# Altium schematic sheet CPCIS_Connectors_P1_P6.SchDoc: =P_Title
size 420 x 297 mm; Author: M.Mroz; CompanyName: WUT ISE; DrawnBy: M.Mroz; Organization: WUT ISE; Address1: PW ISE; Address2: Nowowiejska 15/19 00-665 Warsaw; Address3: gkasprow@gmail.com; Revision: 2; SheetNumber: 19; ModifiedBy: M.Mroz; Title2: CPCIS Connectors
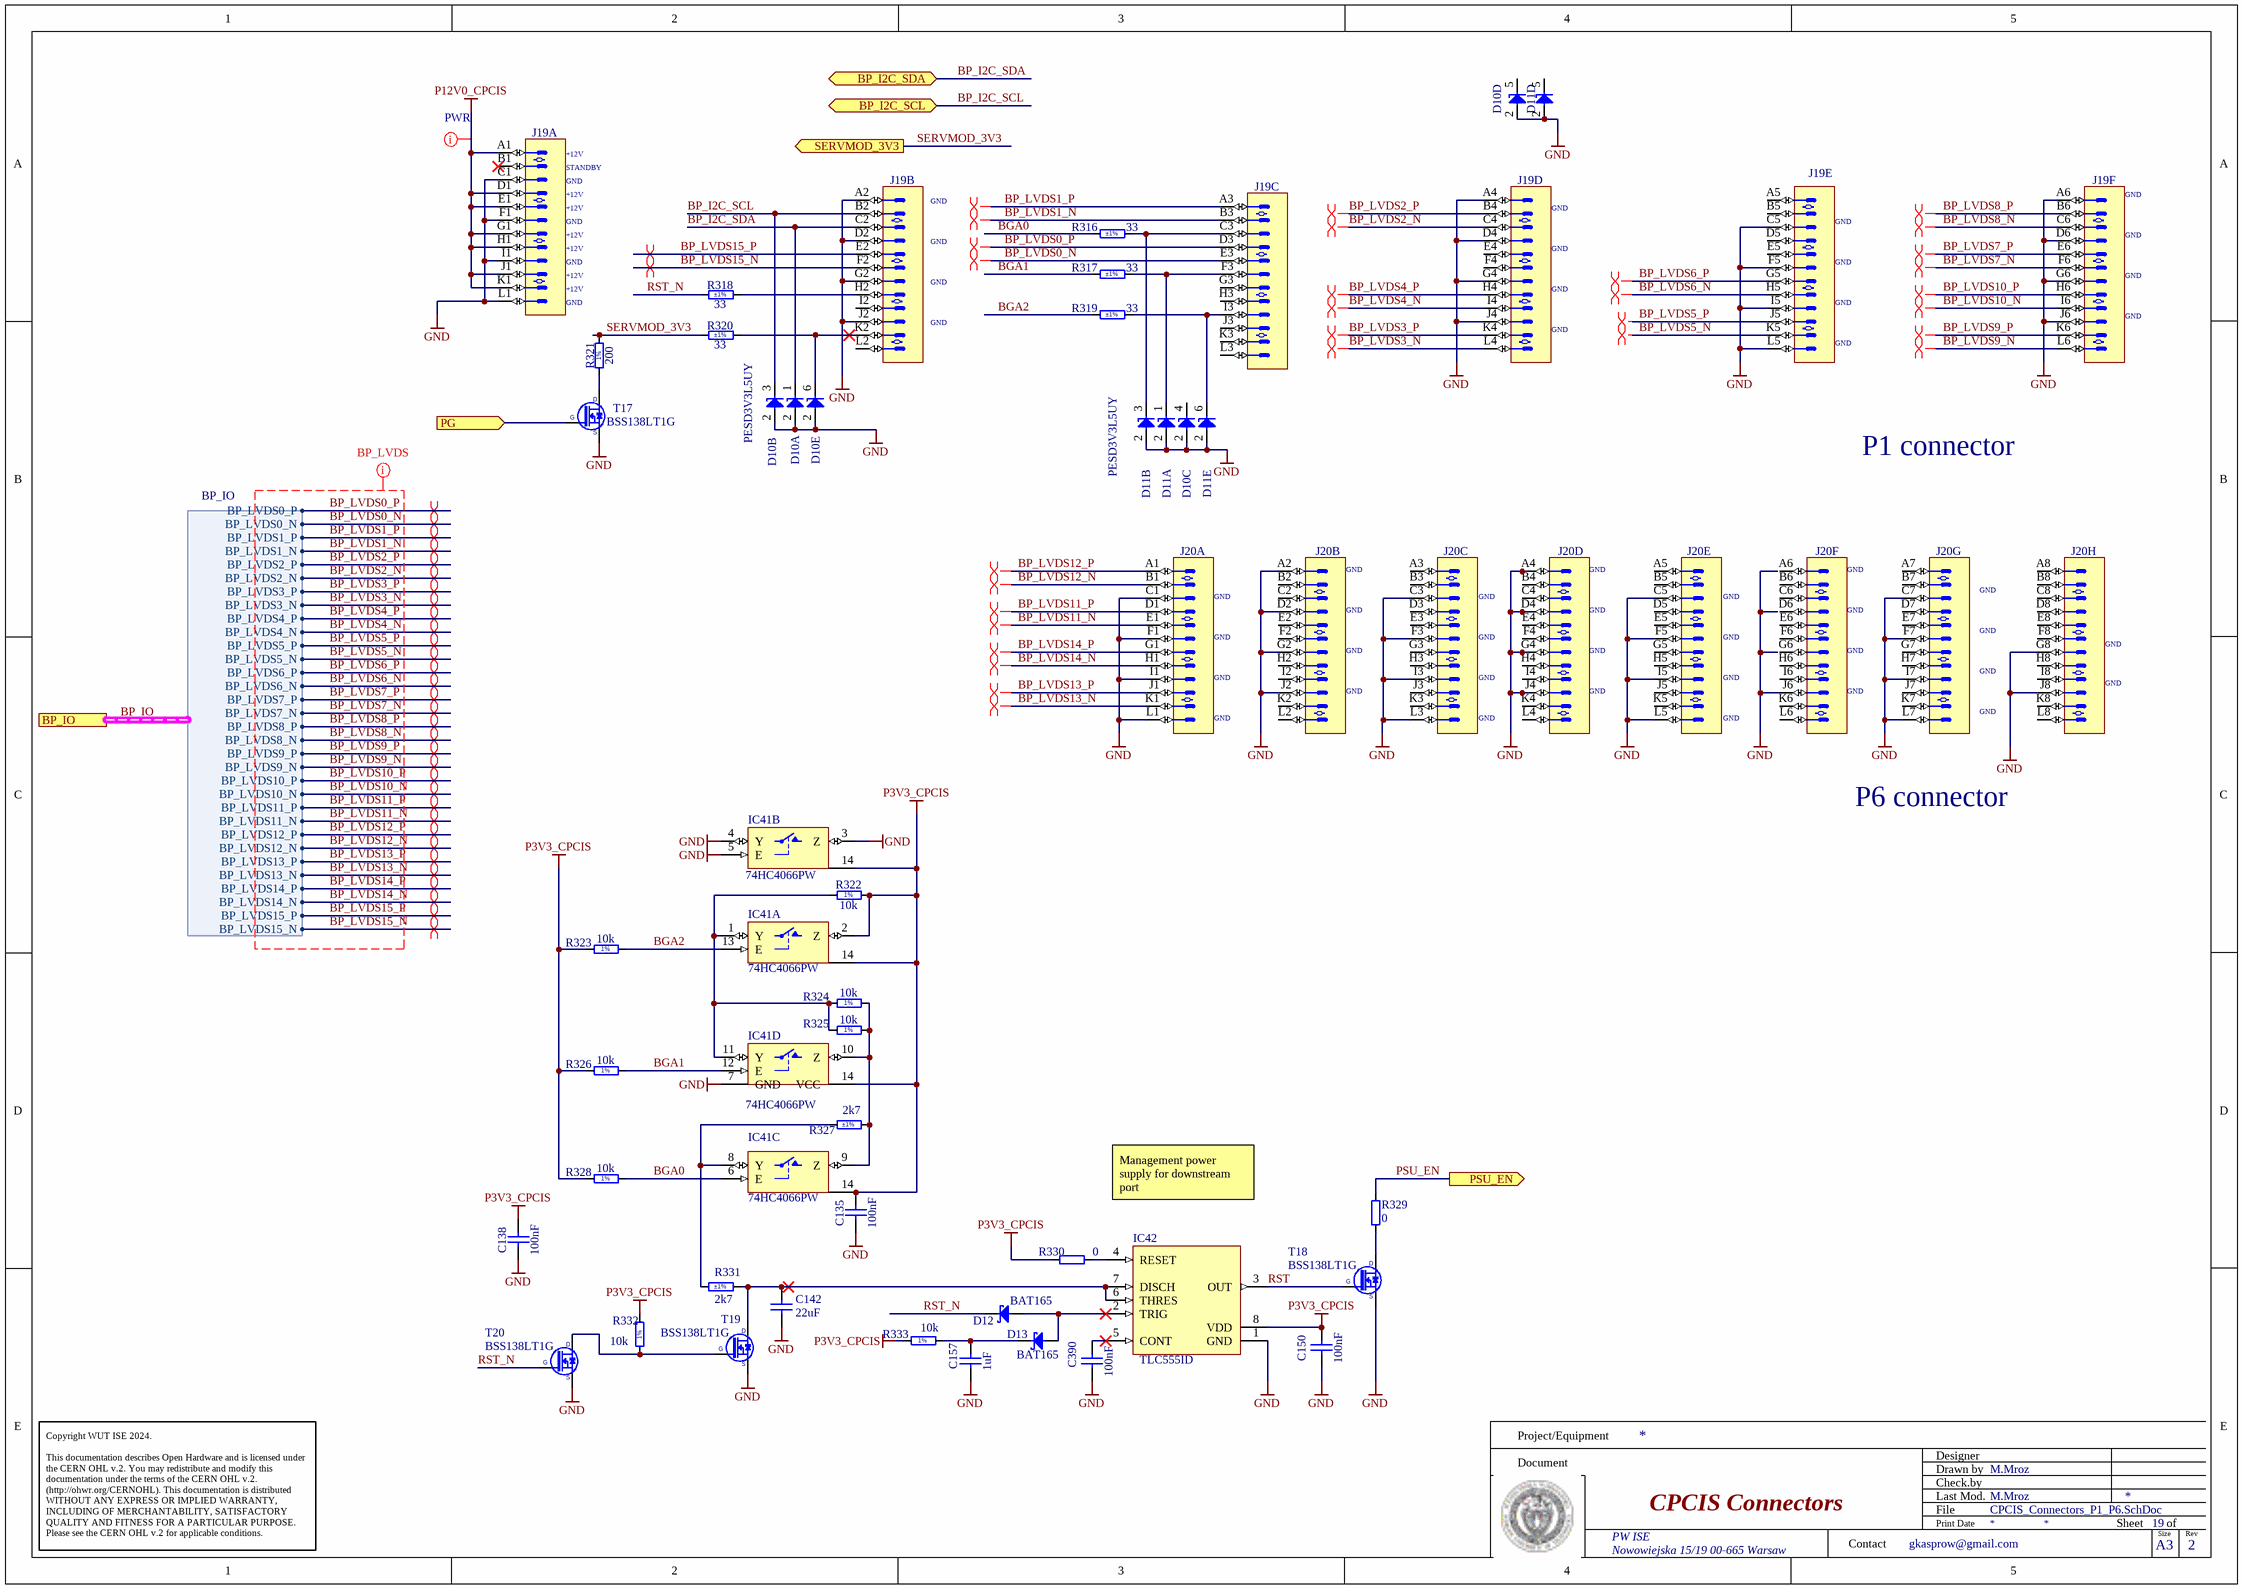
[diagram p0: CPCIS_Connectors_P1_P6.SchDoc]

## Parts
C135  100nF  [CAPC1005X55N]
C138  100nF  [CAPC1005X55N]
C142  22uF  [CAPC2012X135N]
C150  100nF  [CAPC1005X55N]
C157  1uF  [CAPC1608X87N]
C390  100nF  [CAPC1005X55N]
D10  PESD3V3L5UY  [SOT65P210X110-6N]  (value not drawn)  (parts A,B,C,D,E of 5)
D11  PESD3V3L5UY  [SOT65P210X110-6N]  (value not drawn)  (parts A,B,D,E of 5)
D12  BAT165  [SOD2512X110N]
D13  BAT165  [SOD2512X110N]
IC41  74HC4066PW  [SOP65P640X110-14N]  (parts A,B,C,D of 4)
IC42  TLC555ID  [SOIC127P600X175-8N]
J19  (no value)  [AMPHENOL_10052825-101LF]  (parts A,B,C,D,E,F of 6)
J20  (no value)  [AMPHENOL_10052838-101LF]  (parts A,B,C,D,E,F,G,H of 8)
R316  33  Tolerance: ±1%  [RESC1005X40N]
R317  33  Tolerance: ±1%  [RESC1005X40N]
R318  33  Tolerance: ±1%  [RESC1005X40N]
R319  33  Tolerance: ±1%  [RESC1005X40N]
R320  33  Tolerance: ±1%  [RESC1005X40N]
R321  200  [RESC1005X40N]
R322  10k  [RESC1005X40N]
R323  10k  [RESC1005X40N]
R324  10k  [RESC1005X40N]
R325  10k  [RESC1005X40N]
R326  10k  [RESC1005X40N]
R327  2k7  Tolerance: ±1%  [RESC1608X55N]
R328  10k  [RESC1005X40N]
R329  0  [RESC1005X35N]
R330  0  [RESC1005X35N]
R331  2k7  Tolerance: ±1%  [RESC1608X55N]
R332  10k  [RESC1005X40N]
R333  10k  [RESC1005X40N]
T17  BSS138LT1G  [SOT95P240X110-3N]
T18  BSS138LT1G  [SOT95P240X110-3N]
T19  BSS138LT1G  [SOT95P240X110-3N]
T20  BSS138LT1G  [SOT95P240X110-3N]

## Ports
BP_I2C_SCL (bidir), BP_I2C_SDA (bidir), BP_IO (harness BP_IO), PG (in), PSU_EN (out), SERVMOD_3V3 (out)

## Harnesses
BP_IO: BP_LVDS0_P, BP_LVDS0_N, BP_LVDS1_P, BP_LVDS1_N, BP_LVDS2_P, BP_LVDS2_N, BP_LVDS3_P, BP_LVDS3_N, BP_LVDS4_P, BP_LVDS4_N, BP_LVDS5_P, BP_LVDS5_N, BP_LVDS6_P, BP_LVDS6_N, BP_LVDS7_P, BP_LVDS7_N, BP_LVDS8_P, BP_LVDS8_N, BP_LVDS9_P, BP_LVDS9_N, BP_LVDS10_P, BP_LVDS10_N, BP_LVDS11_P, BP_LVDS11_N, BP_LVDS12_P, BP_LVDS12_N, BP_LVDS13_P, BP_LVDS13_N, BP_LVDS14_P, BP_LVDS14_N, BP_LVDS15_P, BP_LVDS15_N

## Nets
GND: C135.1 C138.1 C142.1 C150.1 C157.1 C390.1 D10.2(A) D11.2(A) IC41.3(Z) IC41.4(Y) IC41.5(E) IC41.7(GND) IC42.1(GND) J19.A2 J19.A4 J19.A6 J19.C1 J19.C5 J19.D2 J19.D4 J19.D6 J19.F1 J19.F5 J19.G2 J19.G4 J19.G6 J19.I1 J19.I5 J19.J2 J19.J4 J19.J6 J19.L1 J19.L5 J20.A2 J20.A4 J20.C1 J20.C3 J20.C5 J20.C7 J20.D2 J20.D4 J20.F1 J20.F3 J20.F5 J20.F7 J20.G2 J20.G4 J20.G8 J20.I1 J20.I3 J20.I5 J20.I7 J20.J2 J20.J4 J20.J6 J20.J8 J20.L1 J20.L3 J20.L5 J20.L7 T17.2(S) T18.2(S) T19.2(S) T20.2(S)
P3V3_CPCIS: C135.2 C138.2 C150.2 IC41.2(Z) IC41.14(VCC) IC42.8(VDD) R322.2 R323.1 R326.1 R328.1 R330.2 R332.2 R333.1
P12V0_CPCIS: J19.A1 J19.D1 J19.E1 J19.G1 J19.H1 J19.J1 J19.K1
BGA0: IC41.6(E) R316.1 R328.2
BGA1: IC41.12(E) R317.1 R326.2
BGA2: IC41.13(E) R319.1 R323.2
BP_I2C_SCL: D10.3(C) J19.B2 ; port BP_I2C_SCL
BP_I2C_SDA: D10.1(C) J19.C2 ; port BP_I2C_SDA
BP_LVDS0_N: J19.E3 ; port BP_IO.BP_LVDS0_N  [project net BP_IO.BP_LVDS0_N]
BP_LVDS0_P: J19.D3 ; port BP_IO.BP_LVDS0_P  [project net BP_IO.BP_LVDS0_P]
BP_LVDS1_N: J19.B3 ; port BP_IO.BP_LVDS1_N  [project net BP_IO.BP_LVDS1_N]
BP_LVDS1_P: J19.A3 ; port BP_IO.BP_LVDS1_P  [project net BP_IO.BP_LVDS1_P]
BP_LVDS2_N: J19.C4 ; port BP_IO.BP_LVDS2_N  [project net BP_IO.BP_LVDS2_N]
BP_LVDS2_P: J19.B4 ; port BP_IO.BP_LVDS2_P  [project net BP_IO.BP_LVDS2_P]
BP_LVDS3_N: J19.L4 ; port BP_IO.BP_LVDS3_N  [project net BP_IO.BP_LVDS3_N]
BP_LVDS3_P: J19.K4 ; port BP_IO.BP_LVDS3_P  [project net BP_IO.BP_LVDS3_P]
BP_LVDS4_N: J19.I4 ; port BP_IO.BP_LVDS4_N  [project net BP_IO.BP_LVDS4_N]
BP_LVDS4_P: J19.H4 ; port BP_IO.BP_LVDS4_P  [project net BP_IO.BP_LVDS4_P]
BP_LVDS5_N: J19.K5 ; port BP_IO.BP_LVDS5_N  [project net BP_IO.BP_LVDS5_N]
BP_LVDS5_P: J19.J5 ; port BP_IO.BP_LVDS5_P  [project net BP_IO.BP_LVDS5_P]
BP_LVDS6_N: J19.H5 ; port BP_IO.BP_LVDS6_N  [project net BP_IO.BP_LVDS6_N]
BP_LVDS6_P: J19.G5 ; port BP_IO.BP_LVDS6_P  [project net BP_IO.BP_LVDS6_P]
BP_LVDS7_N: J19.F6 ; port BP_IO.BP_LVDS7_N  [project net BP_IO.BP_LVDS7_N]
BP_LVDS7_P: J19.E6 ; port BP_IO.BP_LVDS7_P  [project net BP_IO.BP_LVDS7_P]
BP_LVDS8_N: J19.C6 ; port BP_IO.BP_LVDS8_N  [project net BP_IO.BP_LVDS8_N]
BP_LVDS8_P: J19.B6 ; port BP_IO.BP_LVDS8_P  [project net BP_IO.BP_LVDS8_P]
BP_LVDS9_N: J19.L6 ; port BP_IO.BP_LVDS9_N  [project net BP_IO.BP_LVDS9_N]
BP_LVDS9_P: J19.K6 ; port BP_IO.BP_LVDS9_P  [project net BP_IO.BP_LVDS9_P]
BP_LVDS10_N: J19.I6 ; port BP_IO.BP_LVDS10_N  [project net BP_IO.BP_LVDS10_N]
BP_LVDS10_P: J19.H6 ; port BP_IO.BP_LVDS10_P  [project net BP_IO.BP_LVDS10_P]
BP_LVDS11_N: J20.E1 ; port BP_IO.BP_LVDS11_N  [project net BP_IO.BP_LVDS11_N]
BP_LVDS11_P: J20.D1 ; port BP_IO.BP_LVDS11_P  [project net BP_IO.BP_LVDS11_P]
BP_LVDS12_N: J20.B1 ; port BP_IO.BP_LVDS12_N  [project net BP_IO.BP_LVDS12_N]
BP_LVDS12_P: J20.A1 ; port BP_IO.BP_LVDS12_P  [project net BP_IO.BP_LVDS12_P]
BP_LVDS13_N: J20.K1 ; port BP_IO.BP_LVDS13_N  [project net BP_IO.BP_LVDS13_N]
BP_LVDS13_P: J20.J1 ; port BP_IO.BP_LVDS13_P  [project net BP_IO.BP_LVDS13_P]
BP_LVDS14_N: J20.H1 ; port BP_IO.BP_LVDS14_N  [project net BP_IO.BP_LVDS14_N]
BP_LVDS14_P: J20.G1 ; port BP_IO.BP_LVDS14_P  [project net BP_IO.BP_LVDS14_P]
BP_LVDS15_N: J19.F2 ; port BP_IO.BP_LVDS15_N  [project net BP_IO.BP_LVDS15_N]
BP_LVDS15_P: J19.E2 ; port BP_IO.BP_LVDS15_P  [project net BP_IO.BP_LVDS15_P]
PG: T17.1(G) ; port PG
PSU_EN: R329.1 ; port PSU_EN
RST: IC42.3(OUT) T18.1(G)
RST_N: D12.1(C) R318.1 T20.1(G)
SERVMOD_3V3: R320.1 R321.2 ; port SERVMOD_3V3
NetC142_2: C142.2 IC42.6(THRES) IC42.7(DISCH) R331.2 T19.3(D)
NetC157_2: C157.2 D13.1(C) R333.2
NetC390_2: C390.2 IC42.5(CONT)
NetD10_6: D10.6(C) J19.K2 R320.2
NetD11_1: D11.1(C) J19.F3 R317.2
NetD11_3: D11.3(C) J19.C3 R316.2
NetD11_6: D11.6(C) J19.I3 R319.2
NetD12_2: D12.2(A) D13.2(A) IC42.2(TRIG)
NetIC41_1: IC41.1(Y) IC41.11(Y) R322.1 R324.1 R325.1
NetIC41_8: IC41.8(Y) R327.1 R331.1
NetIC41_9: IC41.9(Z) IC41.10(Z) R324.2 R325.2 R327.2
NetIC42_4: IC42.4(RESET) R330.1
NetJ19_H2: J19.H2 R318.2
NetR321_1: R321.1 T17.3(D)
NetR329_2: R329.2 T18.3(D)
NetR332_1: R332.1 T19.1(G) T20.3(D)

Not connected (* = marked no-connect by the designer): D10 4(C) 5(C); D11 5(C); J19 A5 B1* B5 D5 E4 E5 F4 G3 H3 I2 J3 K3 L2 L3; J20 A3 A5 A6 A7 A8 B2 B3 B4 B5 B6 B7 B8 C2 C4 C6 C8 D3 D5 D6 D7 D8 E2 E3 E4 E5 E6 E7 E8 F2 F4 F6 F8 G3 G5 G6 G7 H2 H3 H4 H5 H6 H7 H8 I2 I4 I6 I8 J3 J5 J7 K2 K3 K4 K5 K6 K7 K8 L2 L4 L6 L8

## Buses and harness runs
harness BP_IO = port BP_IO

## Layout directives
differential pair: BP_IO.BP_LVDS0_N, BP_IO.BP_LVDS0_P, BP_IO.BP_LVDS1_N, BP_IO.BP_LVDS1_P, BP_IO.BP_LVDS2_N, BP_IO.BP_LVDS2_P, BP_IO.BP_LVDS3_N, BP_IO.BP_LVDS3_P, BP_IO.BP_LVDS4_N, BP_IO.BP_LVDS4_P, BP_IO.BP_LVDS5_N, BP_IO.BP_LVDS5_P, BP_IO.BP_LVDS6_N, BP_IO.BP_LVDS6_P, BP_IO.BP_LVDS7_N, BP_IO.BP_LVDS7_P, BP_IO.BP_LVDS8_N, BP_IO.BP_LVDS8_P, BP_IO.BP_LVDS9_N, BP_IO.BP_LVDS9_P, BP_IO.BP_LVDS10_N, BP_IO.BP_LVDS10_P, BP_IO.BP_LVDS11_N, BP_IO.BP_LVDS11_P, BP_IO.BP_LVDS12_N, BP_IO.BP_LVDS12_P, BP_IO.BP_LVDS13_N, BP_IO.BP_LVDS13_P, BP_IO.BP_LVDS14_N, BP_IO.BP_LVDS14_P, BP_IO.BP_LVDS15_N, BP_IO.BP_LVDS15_P
net class PWR: P12V0_CPCIS
net class BP_LVDS: BP_LVDS0_N, BP_LVDS0_P, BP_LVDS1_N, BP_LVDS1_P, BP_LVDS2_N, BP_LVDS2_P, BP_LVDS3_N, BP_LVDS3_P, BP_LVDS4_N, BP_LVDS4_P, BP_LVDS5_N, BP_LVDS5_P, BP_LVDS6_N, BP_LVDS6_P, BP_LVDS7_N, BP_LVDS7_P, BP_LVDS8_N, BP_LVDS8_P, BP_LVDS9_N, BP_LVDS9_P, BP_LVDS10_N, BP_LVDS10_P, BP_LVDS11_N, BP_LVDS11_P, BP_LVDS12_N, BP_LVDS12_P, BP_LVDS13_N, BP_LVDS13_P, BP_LVDS14_N, BP_LVDS14_P, BP_LVDS15_N, BP_LVDS15_P

## Notes on the sheet
- (near J19) +12V
- (near J19) STANDBY
- (near J19) GND
- +12V
- GND
- P1 connector
- (near J20) GND
- P6 connector
- Management power supply for downstream port
- Project/Equipment
- Document
- Designer
- Drawn by
- Check.by
- Copyright WUT ISE 2024.
  This documentation describes Open Hardware and is licensed under the CERN OHL v.2. You may redistribute and modify this documentation under the terms of the CERN OHL v.2. (http://ohwr.org/CERNOHL). This documentation is distributed WITHOUT ANY EXPRESS OR IMPLIED WARRANTY, INCLUDING OF MERCHANTABILITY, SATISFACTORY QUALITY AND FITNESS FOR A PARTICULAR PURPOSE. Please see the CERN OHL v.2 for applicable conditions.
- Contact
- File
- Last Mod.
- Print Date
- Sheet
- Size
- A3
- of
- Rev
- (in symbol R0402_10K_1%_0.0625W_100PPM) 1%
- (in symbol R0402_200R_1%_0.0625W_100PPM) 1%

## Library data of the parts
C135 C138 C150 C390 = CC0402_100NF_16V_10%_X5R: Non-polarised capacitor; Part Description: SMD Multilayer Chip Ceramic Capacitor; Manufacturer: GENERIC; Manufacturer1 Part Number: GRM155R61C104KA88D; Voltage: 16V; TC: X5R; Tolerance: ±10%; Part Number: CC0402_100NF_16V_10%_X5R; Component Kind: Standard; Component Type: Standard; Pin Count: 2; Value: 100nF; Status: None; Manufacturer Part Number: CC0402_100NF_16V_10%_X5R; Case: 0402; Mounted: Yes; Socket: No; SMD: Yes; Sense: No; Manufacturer1 Example: MURATA; Manufacturer1 ComponentHeight: 0.55mm; HelpURL: \\cern.ch\dfs\Applications\Altium\Datasheets\CC0402_X5R_MURATA_GRM.pdf; Author: CERN DEM JLC; CreateDate: 10.12.2013; LatestRevisionDate: 10.12.2013
C142 = CC0805_22UF_16V_10%_X5R: Non-polarised capacitor; Part Description: SMD Multilayer Chip Ceramic Capacitor; Manufacturer: GENERIC; Manufacturer1 Part Number: C2012X5R1C226KT; Voltage: 16V; TC: X5R; Tolerance: ±10%; Part Number: CC0805_22UF_16V_10%_X5R; Component Kind: Standard; Component Type: Standard; Pin Count: 2; Value: 22uF; Status: Preferred; Manufacturer Part Number: CC0805_22UF_16V_10%_X5R; Case: 0805; Mounted: Yes; Socket: No; SMD: Yes; Sense: No; Manufacturer1 Example: TDK; Manufacturer1 ComponentHeight: 1.35mm; HelpURL: \\cern.ch\dfs\Applications\Altium\Datasheets\CC0805_X5R_TDK_C.pdf; Author: CERN DEM JLC; CreateDate: 25.10.2012; LatestRevisionDate: 25.10.2012
C157 = CC0603_1UF_25V_10%_X7R: Non-polarised capacitor; Part Description: SMD Multilayer Chip Ceramic Capacitor; Manufacturer: GENERIC; Manufacturer1 Part Number: GRM188R71E105KA12D; Voltage: 25V; TC: X7R; Tolerance: ±10%; Part Number: CC0603_1UF_25V_10%_X7R; Component Kind: Standard; Component Type: Standard; Pin Count: 2; Value: 1uF; Status: None; Manufacturer Part Number: CC0603_1UF_25V_10%_X7R; Case: 0603; Mounted: Yes; Socket: No; SMD: Yes; Sense: No; Manufacturer1 Example: MURATA; Manufacturer1 ComponentHeight: 0.9mm; HelpURL: \\cern.ch\dfs\Applications\Altium\Datasheets\CC0603_X7R_MURATA.pdf; Author: CERN DEM JLC; CreateDate: 18.01.2011; LatestRevisionDate: 18.01.2011
D10 D11 = PESD3V3L5UY: Fivefold ESD Protection Diode Arrays; Part Description: Fivefold ESD Protection Diode Arrays (30kV); Manufacturer: NEXPERIA; Voltage: 3.3V; Power: 200W; PressFit: No; Bonding: No; Part Number: PESD3V3L5UY; Component Kind: Standard; Component Type: Standard; Device: PESD3V3L5UY; PackageDescription: SOT363, SC-88, 0.65mm Pitch; 6 Pin, 1.25mm W X 2.00mm L X 1.10mm H body, IPC Medium Density; Manufacturer Part Number: PESD3V3L5UY; Pin Count: 6; Case: SOT363; Mounted: Yes; Socket: No; SMD: Yes; Sense: No; ComponentHeight: 1.1mm; HelpURL: \\cern.ch\dfs\Applications\Altium\Datasheets\PESD3V3L5UY.pdf; Author: CERN DEM WB; CreateDate: 05.07.2021; LatestRevisionDate: 05.07.2021
D12 D13 = BAT165: Schottky Diode; Manufacturer: INFINEON; Part Description: Medium Power AF Schottky Diode; Voltage: 40V; Power: 750mA; PressFit: No; Bonding: No; Manufacturer Part Number: BAT165; PackageDescription: Small Outline Diode (SOD-323), 1.70mm W X 1.25mm L X 1.10mm H body,  IPC Medium Density; Part Number: BAT165; Component Kind: Standard; Component Type: Standard; Device: BAT165; Pin Count: 2; Case: SOD323; Mounted: Yes; Socket: No; SMD: Yes; Sense: No; ComponentHeight: 1.1mm; HelpURL: \\cern.ch\dfs\Applications\Altium\Datasheets\BAT165.pdf; Author: CERN DEM JLC; CreateDate: 12.11.2014; LatestRevisionDate: 12.11.2014
IC41 = 74HC4066PW: Part Description: Quad Single-Pole Single-Throw Analog Switch; Manufacturer: NXP SEMICONDUCTORS; PressFit: No; Bonding: No; Table: Standard Logic; Part Number: 74HC4066PW; Component Kind: Standard; Component Type: Standard; Device: 74HC4066PW; PackageDescription: SOP, 14-Leads, Body 4.4x5mm (max), Pitch 0.65mm, IPC Medium Density; Manufacturer Part Number: 74HC4066PW; Pin Count: 14; Case: TSSOP14; Mounted: Yes; Socket: No; SMD: Yes; ComponentHeight: 1.1mm; Author: CERN DEM JLC; HelpURL: \\cern.ch\dfs\Applications\Altium\Datasheets\74HC4066PW.pdf; CreateDate: 2014-11-19; LatestRevisionDate: 2014-11-19
IC42 = TLC555ID: LinCMOS Timer; Manufacturer: TEXAS INSTRUMENTS; PressFit: No; Bonding: No; Part Number: TLC555ID; Component Kind: Standard; Component Type: Standard; Device: TLC555ID; PackageDescription: SOIC 8, Pitch 1.27mm, Body 4x5mm, IPC Medium Density; Part Description: LinCMOS Timer; Manufacturer Part Number: TLC555ID; Pin Count: 8; Case: SOIC8; Mounted: Yes; Socket: No; SMD: Yes; Sense: No; ComponentHeight: 1.75mm; Author: CERN DEM JMW; HelpURL: \\cern.ch\dfs\Applications\Altium\Datasheets\TLC555ID.pdf; CreateDate: 23.08.2016; LatestRevisionDate: 23.08.2016
J19 = AMPHENOL_10052825-101LF: 72 Contacts Header, 6 Columns, 4 Pairs per Column
J20 = AMPHENOL_10052838-101LF: 96 Contacts Header, 8 Columns, 4 Pairs per Column
R316-R320 = R0402_33R_1%_0.0625W_100PPM: Resistor - 1%; Part Description: General Purpose Thick Film Chip Resistor; Manufacturer: GENERIC; Manufacturer1 Part Number: 232270673309L; TC: ±100ppm/°C; PressFit: No; Part Number: R0402_33R_1%_0.0625W_100PPM; Component Kind: Standard; Component Type: Standard; Pin Count: 2; Value: 33; Status: Not Recommended; Power: 0.0625W; Manufacturer Part Number: R0402_33R_1%_0.0625W_100PPM; Case: 0402; Mounted: Yes; Sense: No; Socket: No; SMD: Yes; Manufacturer1 Example: YAGEO PHYCOMP; Manufacturer1 ComponentHeight: 0.4mm; HelpURL: \\cern.ch\dfs\Applications\Altium\Datasheets\R0402_Phycomp_RC0402.pdf; Author: CERN DEM JLC; CreateDate: 03.12.2007; LatestRevisionDate: 17.10.2012
R321 = R0402_200R_1%_0.0625W_100PPM: Resistor - 1%; Part Description: General Purpose Thick Film Chip Resistor; Manufacturer: GENERIC; Manufacturer1 Part Number: 232270672001L; TC: ±100ppm/°C; PressFit: No; Part Number: R0402_200R_1%_0.0625W_100PPM; Component Kind: Standard; Component Type: Standard; Pin Count: 2; Value: 200; Status: Not Recommended; Power: 0.0625W; Tolerance: ±1%; Manufacturer Part Number: R0402_200R_1%_0.0625W_100PPM; Case: 0402; Mounted: Yes; Sense: No; Socket: No; SMD: Yes; Manufacturer1 Example: YAGEO PHYCOMP; Manufacturer1 ComponentHeight: 0.4mm; HelpURL: \\cern.ch\dfs\Applications\Altium\Datasheets\R0402_Phycomp_RC0402.pdf; Author: CERN DEM JLC; CreateDate: 2007-12-03; LatestRevisionDate: 2012-10-17
R322-R326 R328 R332 R333 = R0402_10K_1%_0.0625W_100PPM: Resistor - 1%; Part Description: General Purpose Thick Film Chip Resistor; Manufacturer: GENERIC; Manufacturer1 Part Number: 232270671003L; TC: ±100ppm/°C; Part Number: R0402_10K_1%_0.0625W_100PPM; Component Kind: Standard; Component Type: Standard; Pin Count: 2; Value: 10k; Status: Not recommended; Power: 0.0625W; Tolerance: ±1%; Manufacturer Part Number: R0402_10K_1%_0.0625W_100PPM; Case: 0402; Mounted: Yes; Sense: No; Socket: No; SMD: Yes; Manufacturer1 Example: YAGEO PHYCOMP; Manufacturer1 ComponentHeight: 0.4mm; HelpURL: \\cern.ch\dfs\Applications\Altium\Datasheets\R0402_Phycomp_RC0402.pdf; Author: CERN DEM JLC; CreateDate: 03.12.2007; LatestRevisionDate: 17.10.2012
R327 R331 = R0603_2K7_1%_0.1W_100PPM: Resistor - 1%; Part Description: General Purpose Thick Film Chip Resistor; Manufacturer: GENERIC; Manufacturer1 Part Number: RC0603FR-072K7L; Power: 0.1W; TC: ±100ppm/°C; PressFit: No; Part Number: R0603_2K7_1%_0.1W_100PPM; Component Kind: Standard; Component Type: Standard; Pin Count: 2; Value: 2k7; Status: Preferred; Manufacturer Part Number: R0603_2K7_1%_0.1W_100PPM; Case: 0603; Mounted: Yes; Sense: No; Socket: No; SMD: Yes; Manufacturer1 Example: YAGEO PHYCOMP; Manufacturer1 ComponentHeight: 0.55mm; HelpURL: \\cern.ch\dfs\Applications\Altium\Datasheets\R0603_PHYCOMP_RC0603.pdf; Author: CERN DEM JLC; CreateDate: 02.05.2011; LatestRevisionDate: 02.05.2011
R329 R330 = R0402_0R_JUMPER: Resistor; Part Description: 1A (0.05R Max DC Resistance) Zero Ohm Jumper; Manufacturer: GENERIC; Manufacturer1 Part Number: 232270591001L; Part Number: R0402_0R_JUMPER; Component Kind: Standard; Component Type: Standard; Footprint: RESC1005X40N; Pin Count: 2; Value: 0; Status: Not recommended; Manufacturer Part Number: R0402_0R_JUMPER; Case: 0402; Mounted: Yes; Sense: No; Socket: No; SMD: Yes; Manufacturer1 Example: YAGEO PHYCOMP; Manufacturer1 ComponentHeight: 0.4mm; HelpURL: \\cern.ch\dfs\Applications\Altium\Datasheets\R0402_Phycomp_RC0402.pdf; Author: CERN DEM JLC; CreateDate: 03.12.2007; LatestRevisionDate: 17.10.2012
T17-T20 = BSS138LT1G: N-CHANNEL MOSFET WITH DIODE; Part Description: 50V, 200mA N-Channel Enhancement Mode Field-Effect Transistor; Manufacturer: ON SEMICONDUCTOR; PressFit: No; Bonding: No; Part Number: BSS138LT1G; Component Kind: Standard; Component Type: Standard; Device: BSS138LT1G; PackageDescription: SOT23, 0.95mm Pitch; 3 Pin, 1.40mm W X 3.00mm L X 1.10mm H body, IPC Medium Density; Manufacturer Part Number: BSS138L; Pin Count: 3; Case: SOT23-3; Mounted: Yes; Socket: No; SMD: Yes; Sense: No; ComponentHeight: 1.11mm; HelpURL: \\cern.ch\dfs\Applications\Altium\Datasheets\BSS138LT1G.pdf; Author: CERN DEM JLC; CreateDate: 23.03.2009; LatestRevisionDate: 25.05.2022